# EAGLE board module_flags_calc (EAGLE 6.5.0)
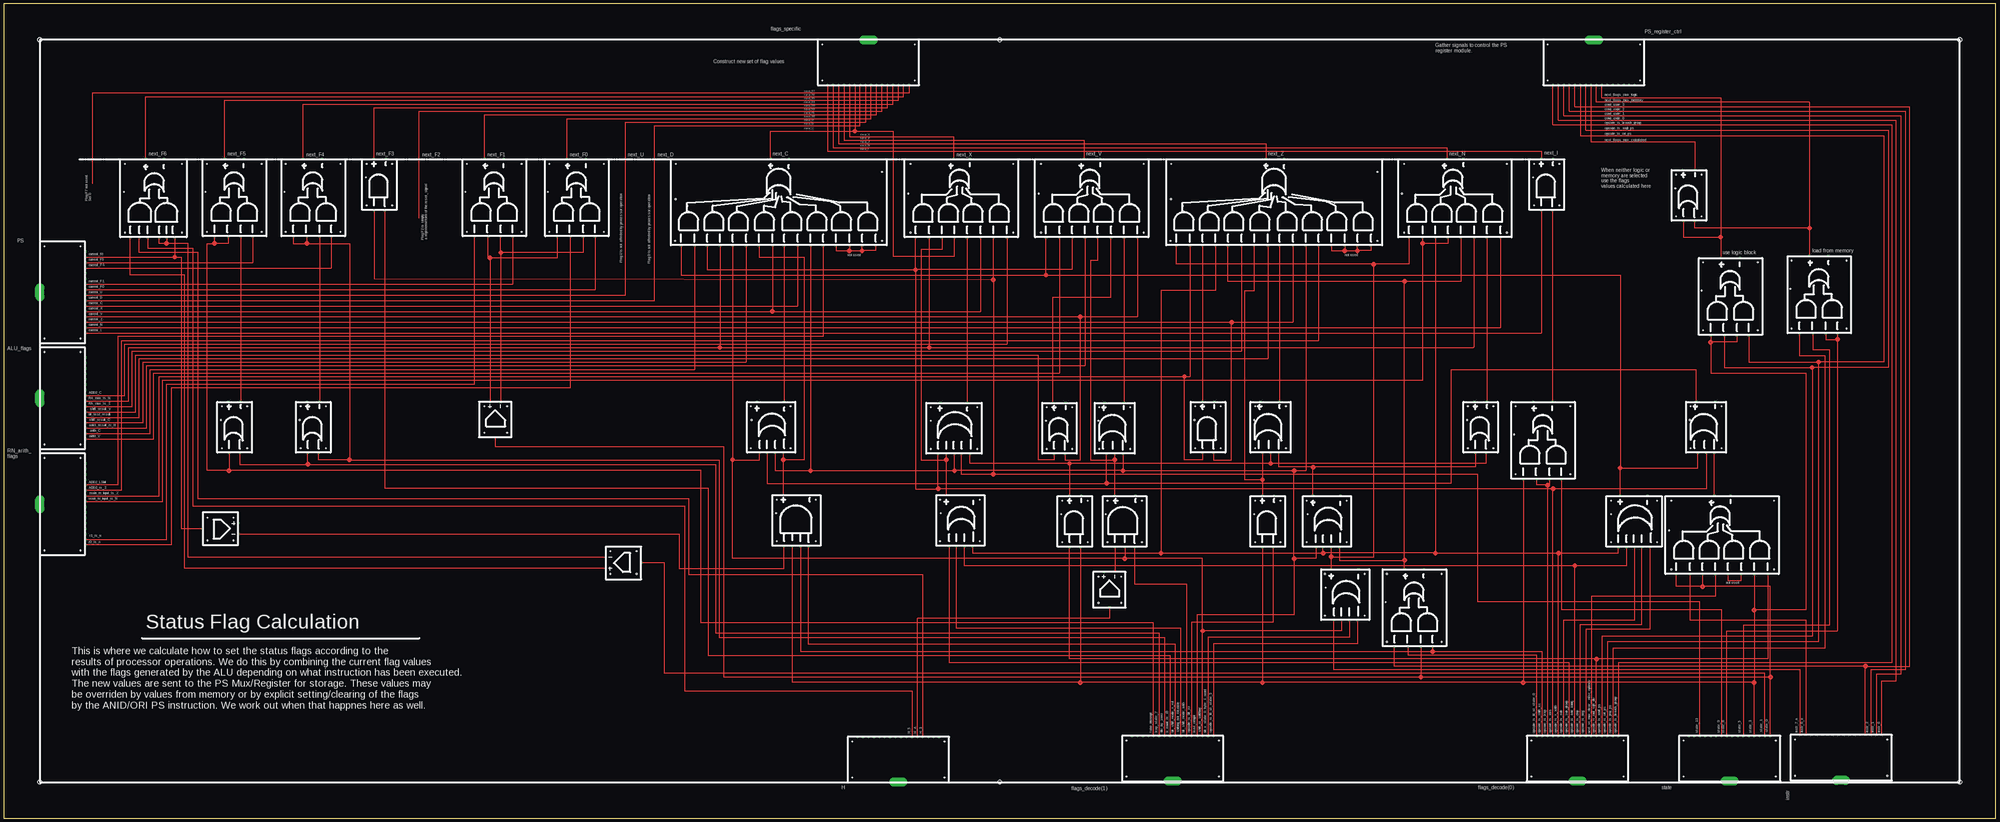
[diagram p14: board, top side]

Size 1397 x 571.5 mm. Coordinates in mm from the lower left corner, seen from the top.
Outline: 0,0 1397,0 1397,571.5 0,571.5 0,0
Copper layers (1*16): Top 0.035mm / dielectric 1.5mm / Bottom 0.035mm
Design rules "default": minimum track width 10mil, minimum drill 24mil, track to track 8mil, track to pad 8mil, pad to pad 8mil, via to via 8mil, smd to smd 8mil, copper to edge 40mil, drill to drill 8mil, minimum pad ring 10mil, minimum via ring 8mil, stop-mask expansion 4mil, vias tented up to drill 0mil, thermal gap 10mil
Holes 2.8 mm at 25.4,546.1 698.5,546.1 1371.6,546.1 1371.6,25.4 698.5,25.4 25.4,25.4
tKeepout: area 16.3,16.3 to 34.5,34.5; area 689.4,16.3 to 707.6,34.5; area 1362.5,16.3 to 1380.7,34.5; area 16.3,537 to 34.5,555.2; area 689.4,537 to 707.6,555.2; area 1362.5,537 to 1380.7,555.2

## Footprints (pad centres in the part's own frame; a part is rotated, then mirrored left to right if it is on the bottom)
5OR = drill 0.8 square: 1 -17.78,-10.795; 2 -17.78,-5.08; 3 -17.78,0; 4 -17.78,5.715; 5 -17.78,11.43; OUT_M 17.78,-8.89; OUT_P 17.78,10.16 | hole 0.6: -14.605,-15.875; 14.605,-15.875; 14.605,16.51; -14.605,16.51; 5.08,16.51
4X2AND_OR = drill 0.8 square: OUT_M 26.67,-6.985; OUT_P 26.67,4.445; P$1 -27.94,-33.02; P$2 -27.94,-23.495; P$3 -27.94,-14.605; P$4 -27.94,-5.08; P$5 -27.94,3.81; P$6 -27.94,12.7; P$7 -27.94,21.59; P$8 -27.94,31.115 | hole 0.6: -24.765,-37.465; 23.495,-37.465; 23.495,34.608; -24.765,34.608; 2.54,36.195
3OR = drill 0.8 square: OUT_M 16.51,-6.985; OUT_P 16.51,6.35; P$1 -19.05,-6.35; P$2 -19.05,-0.635; P$3 -19.05,5.08 | hole 0.6: -15.875,-11.43; 13.335,-11.43; 13.335,10.16; -15.875,10.16; 3.81,10.795
BUS_SPLIT_DISPLAY = drill 0.8 pad 6.452 long: INPUT 0,15.24 | drill 0.8 square: P$1 -28.575,-16.51; P$2 -24.765,-16.51; P$3 -20.955,-16.51; P$4 -17.145,-16.51; P$5 -13.335,-16.51; P$6 -9.525,-16.51; P$7 -5.715,-16.51; P$8 -1.905,-16.51; P$9 1.905,-16.51; P$10 5.715,-16.51; P$11 9.525,-16.51; P$12 13.335,-16.51; P$13 17.145,-16.51; P$14 20.955,-16.51; P$15 24.765,-16.51; P$16 28.575,-16.51 | hole 0.6: -32.385,-13.335; -32.385,12.065; 32.385,12.065; 32.385,-13.335
4OR = drill 0.8 square: 1 -16.51,-8.255; 2 -16.51,-2.54; 3 -16.51,3.175; 4 -16.51,8.255; OUT_M 19.05,-8.89; OUT_P 19.05,10.16 | hole 0.6: -13.335,-13.335; 15.875,-13.335; 15.875,14.605; -13.335,14.605; 6.35,13.97
1BUF = drill 0.8 square: IN -12.7,0; N 12.065,-3.81; P 12.065,3.81 | hole 0.6: -9.525,7.62; -9.525,-8.255; 8.89,-8.255; 8.89,7.62
2AND = drill 0.8 square: OUT_M 19.05,-4.445; OUT_P 19.05,3.81; P$1 -16.51,-3.81; P$2 -16.51,3.81 | hole 0.6: -13.335,8.89; 15.875,-8.89; -13.335,-8.89; 15.875,8.89; 6.35,9.525
2X3AND_OR = drill 0.8 square: OUT_M 27.94,-6.985; OUT_P 27.94,5.715; P$1 -26.67,-14.605; P$2 -26.67,-8.89; P$3 -26.67,-3.81; P$4 -26.67,4.445; P$5 -26.67,10.16; P$6 -26.67,16.51 | hole 0.6: -23.495,-19.685; 24.765,-19.685; 24.765,20.32; -23.495,20.32; 5.08,20.955
2OR = drill 0.8 square: OUT_M 17.78,-4.445; OUT_P 17.78,4.445; P$1 -17.78,-3.81; P$2 -17.78,3.81 | hole 0.6: -14.605,8.89; 14.605,-8.89; 14.605,8.89; -14.605,-8.89; 5.08,9.525
2X2AND_OR = drill 0.8 square: OUT_M 27.94,-6.985; OUT_P 27.94,6.35; P$1 -26.035,-13.335; P$2 -26.035,-5.08; P$3 -26.035,3.81; P$4 -26.035,13.335 | hole 0.6: -22.86,18.733; 24.765,18.733; -22.86,-19.685; 24.765,-19.685; 5.08,19.685
3AND = drill 0.8 square: OUT_M 16.51,-7.62; OUT_P 16.51,6.985; P$1 -19.05,-6.985; P$2 -19.05,0; P$3 -19.05,6.985 | hole 0.6: -15.875,-12.065; 13.335,-12.065; 13.335,12.065; -15.875,12.065; 3.81,13.335
4AND = drill 0.8 square: OUT_M 17.145,-8.89; OUT_P 17.145,9.525; P$1 -18.415,-8.255; P$2 -18.415,-2.54; P$3 -18.415,3.175; P$4 -18.415,8.89 | hole 0.6: -15.24,-13.335; 13.97,-13.335; 13.97,13.97; -15.24,13.97; 4.445,14.605
8X2AND_OR = drill 0.8 square: OUT_M 29.845,-8.89; OUT_P 29.845,3.81; P$1 -30.48,-69.85; P$2 -30.48,-60.325; P$3 -30.48,-51.435; P$4 -30.48,-41.91; P$5 -30.48,-33.02; P$6 -30.48,-24.13; P$7 -30.48,-15.24; P$8 -30.48,-5.715; P$9 -30.48,2.54; P$10 -30.48,12.065; P$11 -30.48,20.955; P$12 -30.48,30.48; P$13 -30.48,39.37; P$14 -30.48,48.26; P$15 -30.48,57.15; P$16 -30.48,66.675 | hole 0.6: -27.305,-74.295; 20.955,-74.295; 26.67,70.168; -27.305,70.802; 1.905,70.485

## Placement (x,y rotation side)
CMP1  5OR  [5OR]  1143.63,208.28 90 top
CMP2  4X2AND_OR  [4X2AND_OR]  1203.96,199.39 90 top
CMP3  3OR  [3OR]  778.51,274.95 90 top
CMP4  BUS_SPLIT_DISPLAY  [BUS_SPLIT_DISPLAY]  1103.63,41.27 180 top
CMP5  4OR  [4OR]  671.2,207.65 90 top
CMP6  BUS_SPLIT_DISPLAY  [BUS_SPLIT_DISPLAY]  40.64,220.34 90 top
CMP7  1BUF  [1BUF]  152.4,203.2 0 top
CMP8  BUS_SPLIT_DISPLAY  [BUS_SPLIT_DISPLAY]  40.64,294.64 90 top
CMP9  BUS_SPLIT_DISPLAY  [BUS_SPLIT_DISPLAY]  627.38,40.64 180 top
CMP10  BUS_SPLIT_DISPLAY  [BUS_SPLIT_DISPLAY]  1288.41,41.91 180 top
CMP11  4OR  [4OR]  928.37,207.01 90 top
CMP12  BUS_SPLIT_DISPLAY  [BUS_SPLIT_DISPLAY]  40.64,368.94 90 top
CMP13  2AND  [2AND]  844.55,273.05 90 top
CMP14  BUS_SPLIT_DISPLAY  [BUS_SPLIT_DISPLAY]  1210.31,41.27 180 top
CMP15  BUS_CONSTRUCT_DISPLAY  [BUS_SPLIT_DISPLAY]  1115.06,530.86 0 top
CMP16  1BUF  [1BUF]  434.34,179.07 180 top
CMP17  2X3AND_OR  [2X3AND_OR]  105.41,434.34 90 top
CMP18  2OR  [2OR]  1181.73,436.88 90 top
CMP28  BUS_CONSTRUCT_DISPLAY  [BUS_SPLIT_DISPLAY]  606.42,530.86 0 top
CMP31  2OR  [2OR]  740.41,273.69 90 top
CMP32  2X2AND_OR  [2X2AND_OR]  1210.31,365.12 90 top
CMP33  2X2AND_OR  [2X2AND_OR]  1272.54,366.39 90 top
CMP34  2AND  [2AND]  751.21,207.01 90 top
CMP38  2X2AND_OR  [2X2AND_OR]  1078.87,264.16 90 top
CMP39  2AND  [2AND]  1082.04,443.23 90 top
CMP43  3OR  [3OR]  1193.16,275.59 90 top
CMP47  3AND  [3AND]  786.13,209.55 90 top
CMP49  4X2AND_OR  [4X2AND_OR]  762,435.61 90 top
CMP50  4AND  [4AND]  556.26,209.55 90 top
CMP51  4OR  [4OR]  538.48,273.05 90 top
CMP52  8X2AND_OR  [8X2AND_OR]  541.65,432.44 90 top
CMP53  1BUF  [1BUF]  775.34,160.66 90 top
CMP56  5OR  [5OR]  666.75,273.69 90 top
CMP57  4X2AND_OR  [4X2AND_OR]  670.56,435.61 90 top
CMP59  4OR  [4OR]  941.07,155.57 90 top
CMP61  2X2AND_OR  [2X2AND_OR]  988.7,146.69 90 top
CMP63  2OR  [2OR]  1035.68,274.32 90 top
CMP64  4X2AND_OR  [4X2AND_OR]  1016.63,435.61 90 top
CMP65  2AND  [2AND]  886.46,207.01 90 top
CMP66  3OR  [3OR]  887.73,275.59 90 top
CMP67  8X2AND_OR  [8X2AND_OR]  889,432.44 90 top
CMP68  2X2AND_OR  [2X2AND_OR]  401.32,434.34 90 top
CMP69  2X2AND_OR  [2X2AND_OR]  343.54,434.34 90 top
CMP70  2AND  [2AND]  263.52,443.23 90 top
CMP71  2OR  [2OR]  217.17,274.32 90 top
CMP72  2X2AND_OR  [2X2AND_OR]  216.53,434.34 90 top
CMP73  2OR  [2OR]  161.93,274.32 90 top
CMP74  2X2AND_OR  [2X2AND_OR]  161.29,434.34 90 top
CMP75  1BUF  [1BUF]  344.81,280.04 90 top
CMP80  BUS_SPLIT_DISPLAY  [BUS_SPLIT_DISPLAY]  819.78,41.27 180 top

## Tracks (layer width: path | path; a pad name or v marks a point on that pad's centre or on a via)
ADD1_RESULT_IS_N
  Top 0.61: CMP49.P$5 758.19,317.5 100.33,317.5 100.33,273.69 CMP8.P$3
ADD2_ADD_C
  Top 0.61: CMP57.P$1 703.58,332.74 85.09,332.74 85.09,296.55 CMP8.P$9
ADD2_IS_Z
  Top 0.61: CMP67.P$5 922.02,335.28 82.55,335.28 82.55,229.87 CMP6.P$11
ADD2_LSB
  Top 0.61: CMP52.P$5 574.67,337.82 80.01,337.82 80.01,233.68 CMP6.P$12
ARITH_C
  Top 0.61: CMP52.P$15 484.5,314.96 102.87,314.96 102.87,269.88 CMP8.P$2
ARITH_V
  Top 0.61: CMP49.P$7 740.41,312.42 105.41,312.42 105.41,266.06 CMP8.P$1
BIT_SHIFT_MODE_ARITH
  Top 0.61: CMP47.P$1 793.12,164.47 829.31,164.47 CMP80.P$6
BIT_SHIFT_MODE_X_ROT
  Top 0.61: CMP80.P$8 821.69,121.92 564.51,121.92 CMP50.P$1
BIT_TEST_RESULT
  Top 0.61: CMP67.P$9 886.46,322.58 95.25,322.58 95.25,281.31 CMP8.P$5
DIV_BY_ZERO
  Top 0.61: CMP72.P$4 203.2,403.23 212.72,403.23 | 212.72,403.23 CMP72.P$3 | 212.72,403.23 242.57,403.23 242.57,251.46 | 242.57,251.46 501.65,251.46 501.65,127 814.07,127 CMP80.P$10 | 242.57,251.46 220.98,251.46 CMP71.P$1
FLAG_C
  Top 0.61: CMP12.P$6 556.89,359.41 CMP52.P$7
FLAG_D
  Top 0.61: CMP12.P$7 456.56,363.22 456.56,485.77 600.71,485.77 CMP28.P$7
FLAG_F0
  Top 0.61: CMP12.P$9 414.65,370.84 CMP68.P$1
FLAG_F1
  Top 0.61: CMP12.P$10 356.87,374.65 CMP69.P$1
FLAG_F4
  Top 0.61: CMP12.P$13 229.87,386.08 CMP72.P$1
FLAG_F5
  Top 0.61: CMP12.P$14 174.62,389.89 CMP74.P$1
FLAG_F6
  Top 0.61: CMP12.P$15 120.02,393.7 | CMP17.P$1 120.02,393.7 | 120.02,393.7 124.46,393.7 124.46,203.2 CMP7.IN
FLAG_F6_N
  Top 0.61: CMP7.N 473.71,199.39 473.71,175.26 547.37,175.26 CMP50.P$4
FLAG_I
  Top 0.61: CMP12.P$1 1078.23,340.36 CMP39.P$2
FLAG_N
  Top 0.61: CMP12.P$2 1049.65,344.17 CMP64.P$1
FLAG_U
  Top 0.61: CMP12.P$8 436.25,367.03 436.25,488.31 604.52,488.31 CMP28.P$8
FLAG_V
  Top 0.61: CMP12.P$4 755.01,351.79 | 755.01,351.79 795.02,351.79 CMP49.P$1 | CMP31.P$1 744.22,251.46 755.01,251.46 755.01,351.79
FLAG_X
  Top 0.61: CMP12.P$5 539.12,355.6 | 539.12,355.6 685.16,355.6 CMP57.P$3 | CMP52.P$9 539.12,355.6
FLAG_Z
  Top 0.61: CMP12.P$3 861.06,347.98 | 861.06,347.98 904.24,347.98 CMP67.P$7 | CMP13.P$1 848.36,251.46 861.06,251.46 861.06,347.98
H_3
  Top 0.61: CMP9.P$4 644.52,170.81 480.69,170.81 480.69,224.16 136.53,224.16 136.53,396.88 95.25,396.88 CMP17.P$5
H_4
  Top 0.61: CMP53.IN 775.34,140.34 640.72,140.34 CMP9.P$5
H_4_N
  Top 0.61: CMP47.P$3 CMP53.N
H_5
  Top 0.61: CMP17.P$4 100.97,400.05 132.72,400.05 132.72,219.07 477.52,219.07 477.52,89.53 636.9,89.53 CMP9.P$6
H_COUNT_IS_15
  Top 0.61: CMP70.P$1 267.33,231.78 494.03,231.78 494.03,114.3 817.88,114.3 CMP80.P$9
HOLD_F0_F1
  Top 0.61: CMP68.P$2 406.4,396.88 348.62,396.88 | 348.62,396.88 CMP69.P$2 | 348.62,396.88 CMP75.N
HOLD_F6
  Top 0.61: CMP16.N 129.54,182.88 129.54,403.23 114.3,403.23 | 114.3,403.23 109.22,403.23 CMP17.P$3 | CMP17.P$2 114.3,403.23
INSTR_0
  Top 0.61: CMP10.P$1 1316.99,96.52 1327.15,96.52 1327.15,489.58 1090.3,489.58 CMP15.P$2
INSTR_1
  Top 0.61: CMP10.P$2 1313.18,100.97 1330.33,100.97 1330.33,492.76 1094.11,492.76 CMP15.P$3
INSTR_2
  Top 0.61: CMP10.P$3 1309.37,104.14 1333.5,104.14 1333.5,495.94 1097.91,495.94 CMP15.P$4
INSTR_3
  Top 0.61: CMP10.P$4 1305.56,106.68 | 1305.56,106.68 975.36,106.68 CMP61.P$4 | 1305.56,106.68 1336.67,106.68 1336.67,499.11 1101.72,499.11 CMP15.P$5
INSTR_6_N
  Top 0.61: CMP2.P$7 1182.37,139.06 1263.65,139.06 CMP10.P$15
IS_SIMPLE_REG_TO_REG
  Top 0.61: CMP10.P$16 1259.84,104.14 932.82,104.14 CMP59.4
LDI_X_STATE_0_BYTE_1_WORD
  Top 0.61: CMP59.2 943.61,127 844.55,127 CMP80.P$2
LOAD_F0_F1
  Top 0.61: CMP68.P$4 387.99,393.06 341,393.06 | 341,393.06 339.73,393.06 CMP69.P$3 | 341,393.06 CMP75.P
LOAD_F6
  Top 0.61: CMP16.P 127,175.26 127,381 88.9,381 CMP17.P$6
LOAD_WEIGHT
  Top 0.61: CMP51.2 541.02,243.84 565.78,243.84 | 565.78,243.84 666.75,243.84 | 666.75,243.84 CMP56.3 | CMP3.P$1 784.86,243.84 | 784.86,243.84 666.75,243.84 | CMP52.P$6 565.78,243.84 | 784.86,243.84 904.88,243.84 | 904.88,243.84 913.13,243.84 CMP67.P$6 | CMP11.4 920.12,182.25 904.88,182.25 | 904.88,182.25 904.88,243.84 | 904.88,182.25 904.88,142.88 836.93,142.88 CMP80.P$4
MAIN_RN_INPUT_MUX_IS_N
  Top 0.61: CMP64.P$5 1012.83,403.23 995.04,403.23 | 995.04,403.23 CMP64.P$7 | CMP6.P$9 111.76,222.25 111.76,307.34 995.04,307.34 995.04,403.23
MAIN_RN_INPUT_MUX_IS_Z
  Top 0.61: CMP6.P$10 109.22,226.06 109.22,309.88 828.04,309.88 | 828.04,309.88 831.85,309.88 CMP67.P$15 | CMP13.P$2 840.74,251.46 828.04,251.46 828.04,309.88
MAIN_RN_INPUT_MUX_IS_Z_EXTENDED
  Top 0.61: CMP67.P$14 CMP13.OUT_P
N$1
  Top 0.61: CMP2.P$4 1209.04,167 1218.57,167 CMP2.P$3
N$10
  Top 0.61: CMP52.P$1 611.5,398.14 601.98,398.14 | 601.98,398.14 CMP52.P$2 | CMP52.P$4 583.57,398.14 593.09,398.14 | 593.09,398.14 601.98,398.14 | CMP52.P$3 593.09,398.14
N$16
  Top 0.61: CMP67.P$1 958.85,398.14 949.33,398.14 | 949.33,398.14 CMP67.P$2 | CMP67.P$3 940.43,398.14 | 940.43,398.14 949.33,398.14 | CMP67.P$4 930.91,398.14 940.43,398.14
N$17
  Top 0.61: CMP28.P$16 635,508.63 62.23,508.63 62.23,445.13
NEXT_C_MUX_HOLD
  Top 0.61: CMP52.P$8 CMP51.OUT_M
NEXT_C_MUX_X
  Top 0.61: CMP50.OUT_P 546.74,251.46 | 546.74,251.46 CMP51.1 | CMP52.P$10 529.59,393.7 561.34,393.7 561.34,251.46 546.74,251.46
NEXT_C_SPECIFIC
  Top 0.61: CMP52.OUT_P 537.85,481.96 596.9,481.96 | CMP28.P$6 596.9,481.96 | 596.9,481.96 623.57,481.96 623.57,394.33 666.75,394.33 CMP57.P$5
NEXT_F0_SPECIFIC
  Top 0.61: CMP68.OUT_P 394.97,490.86 608.33,490.86 CMP28.P$9
NEXT_F1_SPECIFIC
  Top 0.61: CMP69.OUT_P 337.19,493.39 612.14,493.39 CMP28.P$10
NEXT_F3_SPECIFIC
  Top 0.61: CMP70.OUT_P 259.71,498.48 619.76,498.48 CMP28.P$12
NEXT_F4_HOLD
  Top 0.61: CMP72.P$2 CMP71.OUT_M
NEXT_F4_SPECIFIC
  Top 0.61: CMP72.OUT_P 210.19,501.01 623.57,501.01 CMP28.P$13
NEXT_F5_HOLD
  Top 0.61: CMP74.P$2 CMP73.OUT_M
NEXT_F5_SPECIFIC
  Top 0.61: CMP74.OUT_P 154.94,503.56 627.38,503.56 CMP28.P$14
NEXT_F6_SPECIFIC
  Top 0.61: CMP17.OUT_P 99.69,506.1 631.19,506.1 CMP28.P$15
NEXT_I_MUX_HOLD
  Top 0.61: CMP39.P$1 CMP38.OUT_M
NEXT_I_SPECIFIC
  Top 0.61: CMP28.P$1 577.85,468 1078.23,468 CMP39.OUT_P
NEXT_N_MUX_HOLD
  Top 0.61: CMP64.P$2 CMP63.OUT_M
NEXT_N_SPECIFIC
  Top 0.61: CMP28.P$2 581.66,470.54 1012.19,470.54 CMP64.OUT_P
NEXT_NZ_MUX_COMMON
  Top 0.61: CMP11.OUT_P 918.21,246.38 | 918.21,246.38 894.08,246.38 CMP66.P$1 | CMP63.P$2 1031.88,246.38 918.21,246.38
NEXT_NZ_MUX_MAIN
  Top 0.61: CMP64.P$8 985.52,388.62 960.75,388.62 | 960.75,388.62 822.33,388.62 CMP67.P$16 | CMP59.OUT_P 930.91,183.51 | 930.91,183.51 960.75,183.51 960.75,388.62 | 930.91,183.51 CMP11.2
NEXT_NZ_MUX_RAC
  Top 0.61: CMP64.P$4 1021.72,376.56 982.35,376.56 | 982.35,376.56 858.52,376.56 CMP67.P$12 | CMP11.1 936.62,180.97 982.35,180.97 | 982.35,180.97 982.35,376.56 | CMP61.OUT_P 982.35,180.97
NEXT_V_MUX_ASL
  Top 0.61: CMP47.OUT_P 779.14,251.46 | 779.14,251.46 CMP3.P$2 | CMP49.P$4 767.08,391.16 762,391.16 762,251.46 779.14,251.46
NEXT_V_MUX_HOLD
  Top 0.61: CMP49.P$2 CMP3.OUT_M
NEXT_V_SPECIFIC
  Top 0.61: CMP28.P$4 589.28,475.62 757.55,475.62 CMP49.OUT_P
NEXT_VC_MUX_ARITH
  Top 0.61: CMP52.P$16 474.98,381 730.88,381 | 730.88,381 CMP49.P$8 | CMP1.OUT_P 1133.47,245.75 | 1133.47,245.75 1188.09,245.75 CMP43.P$3 | 730.88,381 1133.47,381 1133.47,245.75
NEXT_VC_MUX_CLEAR
  Top 0.61: CMP2.OUT_P CMP43.P$1
NEXT_VC_MUX_CLEAR__MISC_OPTIONS
  Top 0.61: CMP2.P$5 1200.15,155.57 1113.15,155.57 CMP4.P$6
NEXT_VC_MUX_COMMON
  Top 0.61: CMP51.3 535.3,234.95 773.43,234.95 | 773.43,234.95 CMP3.P$3 | CMP43.OUT_P 1186.82,314.32 1014.73,314.32 1014.73,234.95 773.43,234.95
NEXT_X_MUX_HOLD
  Top 0.61: CMP57.P$4 CMP56.OUT_M
NEXT_X_MUX_UPDATE
  Top 0.61: CMP5.OUT_P 661.03,251.46 | 661.03,251.46 CMP56.4 | CMP57.P$6 657.86,398.78 643.25,398.78 643.25,251.46 661.03,251.46
NEXT_X_SPECIFIC
  Top 0.61: CMP28.P$5 593.09,478.15 666.12,478.15 CMP57.OUT_P
NEXT_XNZVC_MUX_CPLX_CLR
  Top 0.61: CMP63.P$1 1039.49,248.92 888.37,248.92 | 888.37,248.92 747.39,248.92 | 747.39,248.92 CMP34.OUT_P | CMP66.P$2 888.37,248.92 | 747.39,248.92 677.54,248.92 CMP56.1
NEXT_XNZVC_MUX_LOGIC
  Top 0.61: CMP18.P$2 1177.92,407.67 1203.96,407.67 | 1203.96,407.67 CMP32.OUT_P | 1203.96,407.67 1203.96,505.46 1120.78,505.46 CMP15.P$10
NEXT_XNZVC_MUX_MEMORY
  Top 0.61: CMP18.P$1 1185.55,414.02 1266.19,414.02 | 1266.19,414.02 CMP33.OUT_P | 1266.19,414.02 1266.19,502.29 1116.96,502.29 CMP15.P$9
NEXT_XNZVC_MUX_SPECIFIC
  Top 0.61: CMP18.OUT_M 1186.18,474.35 1113.15,474.35 CMP15.P$8
NEXT_Z_HOLD
  Top 0.61: CMP67.P$8 CMP66.OUT_M
NEXT_Z_MUX_BIT_TEST
  Top 0.61: CMP66.P$3 882.65,237.49 | 882.65,237.49 870.59,237.49 870.59,370.2 876.93,370.2 CMP67.P$10 | 882.65,237.49 CMP65.OUT_P
NEXT_Z_SPECIFIC
  Top 0.61: CMP28.P$3 585.47,473.07 885.19,473.07 CMP67.OUT_P
OPCODE_IS_ABS
  Top 0.61: CMP49.P$6 749.3,384.81 639.45,384.81 | 639.45,384.81 CMP57.P$8 | CMP52.P$14 493.39,384.81 639.45,384.81 | CMP43.P$2 1193.8,231.14 1086.48,231.14 | 639.45,384.81 639.45,231.14 655.32,231.14 | 655.32,231.14 CMP56.5 | 1086.48,231.14 655.32,231.14 | CMP4.P$13 1086.48,231.14
OPCODE_IS_ADD_ADDQ
  Top 0.61: CMP1.4 1137.92,177.16 1101.72,177.16 | 1101.72,177.16 673.74,177.16 CMP5.2 | CMP4.P$9 1101.72,177.16
OPCODE_IS_ANDI_PS
  Top 0.61: CMP32.P$3 1206.5,316.23 1268.1,316.23 | 1268.1,316.23 1268.1,127.64 1120.78,127.64 CMP4.P$4 | 1268.1,316.23 1321.43,316.23 1321.43,482.6 1109.35,482.6 CMP15.P$7
OPCODE_IS_BIT_XX
  Top 0.61: CMP80.P$5 833.12,137.79 890.27,137.79 CMP65.P$1
OPCODE_IS_BRANCH_GROUP
  Top 0.61: CMP4.P$1 1132.2,109.22 1323.97,109.22 1323.97,486.41 1086.48,486.41 CMP15.P$1
OPCODE_IS_CMP
  Top 0.61: CMP4.P$8 1105.54,135.89 1148.71,135.89 CMP1.2
OPCODE_IS_LD_ST_STATE_0
  Top 0.61: CMP4.P$16 1075.06,114.3 984.88,114.3 CMP61.P$3
OPCODE_IS_LD_ST_STATE_5
  Top 0.61: CMP59.1 949.33,122.56 848.36,122.56 CMP80.P$1
OPCODE_IS_MUL_SQRT_DIV
  Top 0.61: CMP2.P$1 1236.98,111.76 1116.96,111.76 | 1116.96,111.76 747.39,111.76 CMP34.P$2 | CMP4.P$5 1116.96,111.76
OPCODE_IS_NEG
  Top 0.61: CMP1.1 1154.43,132.72 1109.35,132.72 CMP4.P$7
OPCODE_IS_ORI_PS
  Top 0.61: CMP32.P$1 1223.64,320.04 1272.54,320.04 | 1272.54,320.04 1272.54,123.83 1124.59,123.83 CMP4.P$3 | CMP15.P$6 1105.54,478.79 1318.26,478.79 1318.26,320.04 1272.54,320.04
OPCODE_IS_POP_PS
  Top 0.61: CMP33.P$4 1259.2,324.49 1276.98,324.49 1276.98,119.38 1128.39,119.38 CMP4.P$2
OPCODE_IS_SHIFT_XX
  Top 0.61: CMP4.P$15 1078.87,116.84 1002.03,116.84 | CMP61.P$1 1002.03,116.84 | 1002.03,116.84 558.8,116.84 CMP50.P$2
OPCODE_IS_SUB
  Top 0.61: CMP4.P$11 1094.11,139.06 1143.63,139.06 CMP1.3
OPCODE_IS_SUB_GROUP
  Top 0.61: CMP4.P$10 1097.91,109.22 662.94,109.22 CMP5.4
OPCODE_IS_TRAP
  Top 0.61: CMP38.P$2 1083.94,233.68 1082.67,233.68 | 1082.67,233.68 1075.06,233.68 CMP38.P$3 | CMP4.P$14 1082.67,233.68
OPCODE_IS_X_ARITH
  Top 0.61: CMP64.P$6 1003.93,186.06 | 1003.93,186.06 925.2,186.06 | 925.2,186.06 CMP11.3 | CMP5.1 679.45,186.06 811.53,186.06 | 811.53,186.06 925.2,186.06 | 1003.93,186.06 1090.3,186.06 | 1090.3,186.06 1132.2,186.06 CMP1.5 | CMP4.P$12 1090.3,186.06 | CMP67.P$13 849.63,370.2 811.53,370.2 811.53,186.06
R0_IS_N
  Top 0.61: CMP68.P$3 397.51,302.26 117.47,302.26 117.47,191.77 CMP6.P$1
R1_IS_N
  Top 0.61: CMP6.P$2 114.3,195.58 114.3,304.8 330.2,304.8 CMP69.P$4
RA_MUX_IS_N
  Top 0.61: 502.29,330.2 648.97,330.2 | 648.97,330.2 1030.61,330.2 1031.24,330.83 CMP64.P$3 1031.24,408.31 | CMP52.P$13 502.29,330.2 | CMP57.P$7 648.97,330.2 | CMP8.P$8 87.63,292.74 87.63,330.2 502.29,330.2
RA_MUX_IS_Z
  Top 0.61: CMP67.P$11 868.04,327.66 90.17,327.66 90.17,288.93 CMP8.P$7
RESET_SIGNAL
  Top 0.61: 291.46,421 291.46,495.94 615.95,495.94 CMP28.P$11
SHIFT_IS_SHIFTING
  Top 0.61: CMP52.P$12 511.18,251.46 | 511.18,251.46 530.23,251.46 CMP51.4 | CMP47.P$2 786.13,182.25 | 786.13,182.25 511.18,182.25 511.18,251.46 | CMP59.3 937.89,131.44 840.74,131.44 | 840.74,131.44 840.74,182.25 786.13,182.25 | CMP80.P$3 840.74,131.44
SHIFT_RESULT_C_FLAG
  Top 0.61: CMP52.P$11 520.7,320.04 97.79,320.04 97.79,277.5 CMP8.P$4
SHIFT_RESULT_V_FLAG
  Top 0.61: CMP31.P$2 736.6,251.46 725.8,251.46 725.8,325.12 92.71,325.12 92.71,285.12 CMP8.P$6
SHIFTING_NOT_ROTATION
  Top 0.61: CMP80.P$7 825.5,133.35 668.02,133.35 CMP5.3
STATE_0
  Top 0.61: CMP2.P$6 1191.26,162.56 | 1191.26,162.56 1172.85,162.56 CMP2.P$8 | CMP14.P$1 1238.88,99.06 | 1238.88,99.06 1238.88,162.56 1191.26,162.56 | 1238.88,99.06 993.77,99.06 | 993.77,99.06 504.82,99.06 504.82,260.99 344.81,260.99 CMP75.IN | CMP61.P$2 993.77,99.06
STATE_1
  Top 0.61: CMP14.P$2 1235.08,101.6 463.55,101.6 463.55,179.07 CMP16.IN
STATE_3
  Top 0.61: CMP14.P$4 1227.45,95.25 | 1227.45,95.25 1065.53,95.25 | 1065.53,95.25 882.65,95.25 | 882.65,95.25 755.01,95.25 | 755.01,95.25 553.09,95.25 CMP50.P$3 | CMP2.P$2 1227.45,146.05 | 1227.45,146.05 1227.45,95.25 | CMP38.P$4 1065.53,95.25 | CMP65.P$2 882.65,95.25 | CMP32.P$4 1196.97,334.01 | 1196.97,334.01 1196.97,312.42 1263.65,312.42 1263.65,146.05 1227.45,146.05 | CMP32.P$2 1215.39,334.01 1196.97,334.01 | CMP34.P$1 755.01,95.25
STATE_5
  Top 0.61: CMP33.P$3 1268.73,328.93 1280.16,328.93 1280.16,135.25 1219.84,135.25 CMP14.P$6
STATE_8
  Top 0.61: CMP33.P$1 1285.88,335.92 | 1285.88,335.92 1285.88,131.44 1208.4,131.44 CMP14.P$9 | CMP33.P$2 1277.62,335.92 1285.88,335.92
STATE_9
  Top 0.61: CMP38.P$1 1092.2,146.69 1204.6,146.69 CMP14.P$10
STATE_13
  Top 0.61: CMP70.P$2 259.71,378.46 694.05,377.82 | 694.05,377.82 CMP57.P$2 | CMP14.P$14 1189.36,151.76 1033.78,151.76 1033.78,241.3 694.05,241.3 | 694.05,241.3 671.83,241.3 CMP56.2 | 694.05,377.82 694.05,241.3
STICKY_V
  Top 0.61: CMP31.OUT_P 735.97,365.76 776.61,365.76 CMP49.P$3
TAKE_INTERRUPT
  Top 0.61: CMP74.P$3 157.48,403.23 147.96,403.23 | 147.96,403.23 CMP74.P$4 | CMP73.P$2 158.12,243.84 | 158.12,243.84 142.88,243.84 142.88,403.23 147.96,403.23 | CMP80.P$12 806.45,137.16 488.95,137.16 488.95,243.84 158.12,243.84
TRAP_STATE_7
  Top 0.61: CMP73.P$1 165.74,248.28 213.36,248.28 | 213.36,248.28 CMP71.P$2 | 213.36,248.28 499.11,248.28 499.11,130.18 810.26,130.18 CMP80.P$11
(copper drawn outside any net)
  shapes: Top circle x71

## Text on the board
tPlace: flags_specific | PS_register_ctrl | Gather signals to control the PS / register module. | Construct new set of flag values | next_F7 | next_F6 | next_flags_mux_logic | next_F5 | next_flags_mux_memory | next_F4 | cond_code_3 | next_F3 | next_F2 | cond_code_2 | next_F1 | cond_code_1 | next_F0 | cond_code_0 | next_U | opcode_is_branch_group | next_D | next_C | opcode_is_andi_ps | next_X | opcode_is_ori_ps | next_V | next_flags_mux_calculated | next_Z | next_N | next_I | next_F6 | next_F5 | next_F3 | next_C | next_V | next_Z | next_N | next_I | next_F4 | next_F2 | next_F1 | next_F0 | next_U | next_D | next_X | When neither logic or / memory are selected / use the flags / values calculated here | Flag F7 not used. / Set 0 | Flag F2 is simply / a registered form of the reset_signal | PS | load from memory | use logic block | current_f6 | not used | not used | current_F5 | Flag U is not affected by processor operation | Flag D is not affected by processor operation | current_F4 | current_F1 | current_F0 | current_U | current_D | current_C | current_X | current_V | current_Z | current_N | current_I | ALU_flags | ADD2_C | RA_mux_is_N | RA_mux_is_Z | shift_result_V | bit_test_result | shift_result_C | add1_result_is_N | arith_C | airith_V | RN_arith_ / flags | ADD2_LSbit | ADD2_is_Z | main_rn_input_is_Z | main_rn_input_is_N | r1_is_n | r0_is_n | not used | Status Flag Calculation | This is where we calculate how to set the status flags according to the / results of processor operations. We do this by combining the current flag values / with the flags generated by the ALU depending on what instruction has been executed. / The new values are sent to the PS Mux/Register for storage. These values may / be overriden by values from memory or by explicit setting/clearing of the flags / by the ANID/ORI PS instruction. We work out when that happnes here as well. | H_5 | H_4 | H_3 | take_interrupt | trap_state_7 | div_by_zero | h_count_is_15 | bit_shift_mode_x_rot | shifting_not_rotation | bit_shift_mode_arith | opcode_is_bit_xx | load_weight | shift_is_shitfting | ldi_x_state_0_byte_1_word | opcode_is_ld_st_state_5 | opcode_is_ld_st_state_0 | opcode_is_shift_xx | opcode_is_trap | opcode_is_abs | opcode_is_x_arith | opcode_is_sub | opcode_is_sub_group | opcode_is_add_addq | opcode_is_cmp | opcode_is_neg | next_vc_mux_clear__misc_options | opcode_is_mul_sqrt_div | opcode_is_andi_ps | opcode_is_ori_ps | opcode_is_pop_ps | opcode_is_branch_group | state_13 | state_9 | state_8 | state_5 | state_3 | state_1 | state_0 | instr_7_n | instr_6_n | instr_2 | instr_1 | instr_0 | H | flags_decode(1) | flags_decode(0) | state | instr